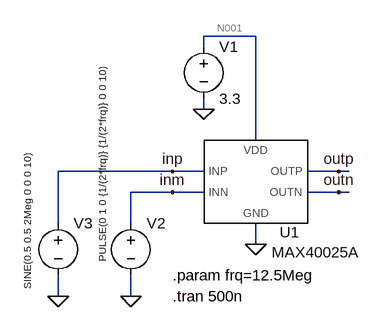
[diagram p0: schematic 01-max40025a.asc]
01-max40025a.asc, the LTspice schematic file:
Version 4
SHEET 1 880 680
WIRE 112 -64 32 -64
WIRE 32 -48 32 -64
WIRE 32 48 32 32
WIRE 112 96 112 -64
WIRE -16 144 -192 144
WIRE 32 144 -16 144
WIRE 240 144 192 144
WIRE 256 144 240 144
WIRE -16 176 -80 176
WIRE 32 176 -16 176
WIRE 240 176 192 176
WIRE 256 176 240 176
WIRE -192 224 -192 144
WIRE -80 224 -80 176
WIRE 112 256 112 224
WIRE -192 336 -192 304
WIRE -80 336 -80 304
FLAG 32 48 0
FLAG -80 336 0
FLAG -192 336 0
FLAG -16 144 inp
FLAG -16 176 inm
FLAG 112 256 0
FLAG 240 144 outp
FLAG 240 176 outn
SYMBOL voltage 32 -64 R0
WINDOW 123 0 0 Left 0
WINDOW 39 0 0 Left 0
SYMATTR InstName V1
SYMATTR Value 3.3
SYMBOL voltage -80 208 R0
WINDOW 3 -44 -221 VRight 1
WINDOW 123 0 0 Left 0
WINDOW 39 0 0 Left 0
SYMATTR Value PULSE(0 1 0 {1/(2*frq)} {1/(2*frq)} 0 0 10)
SYMATTR InstName V2
SYMBOL voltage -192 208 R0
WINDOW 3 -47 -88 VRight 1
WINDOW 123 0 0 Left 0
WINDOW 39 0 0 Left 0
SYMATTR Value SINE(0.5 0.5 2Meg 0 0 0 10)
SYMATTR InstName V3
SYMBOL MAX40025A 96 176 R0
SYMATTR InstName U1
TEXT -16 304 Left 2 !.param frq=12.5Meg
TEXT -16 336 Left 2 !.tran 500n

The netlist it stands for:
* 01-max40025a.asc
V1 N001 0 3.3
V2 inm 0 PULSE(0 1 0 {1/(2*frq)} {1/(2*frq)} 0 0 10)
V3 inp 0 SINE(0.5 0.5 2Meg 0 0 0 10)
XU1 inp inm 0 N001 outp outn MAX40025A  ; pins INP INN GND VDD OUTP OUTN
.param frq=12.5Meg
.tran 500n
.lib C:\Users\hop\Documents\GitHub\LTspice\01-lib\max40025a.lib
.backanno
.end

* Results of the author's LTspice run, read from the files saved beside the schematic
* Operating Point, zero values left out:
*   V(n001) = 3.3 V
*   V(inp) = 500 mV
*   V(outp) = 1.425 V
*   V(outn) = 1.075 V
*   I(V1) = -17.35 mA
*   I(V2) = 9.997 mA
*   I(V3) = -5 µA
*   Ix(u1:INP) = 5 µA
*   Ix(u1:INN) = -9.997 mA
*   Ix(u1:VDD) = 17.35 mA
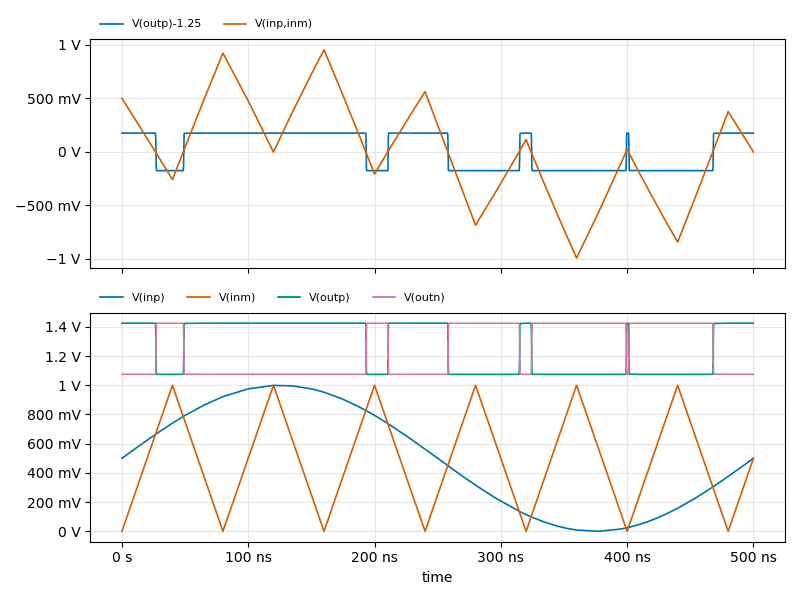
[diagram p1: Transient Analysis of 01-max40025a.asc, plotted from the saved traces]
* Transient Analysis, 1 run:
*   V(outp)-1.25: min -175.1 mV, max 175.5 mV, average 8.487 mV, rms 174.4 mV, last 175 mV
*   V(inp,inm): min -991.1 mV, max 952.4 mV, average 9.864 mV, rms 472.9 mV, last 0 V
*   V(inp): min 250.2 µV, max 999.1 mV, average 499.9 mV, rms 612.1 mV, last 500 mV
*   V(inm): min 0 V, max 1 V, average 490 mV, rms 584.5 mV, last 500 mV
*   V(outp): min 1.075 V, max 1.426 V, average 1.258 V, rms 1.27 V, last 1.425 V
*   V(outn): min 1.074 V, max 1.425 V, average 1.241 V, rms 1.254 V, last 1.075 V